# EAGLE schematic Schematic (EAGLE 8.3.2)
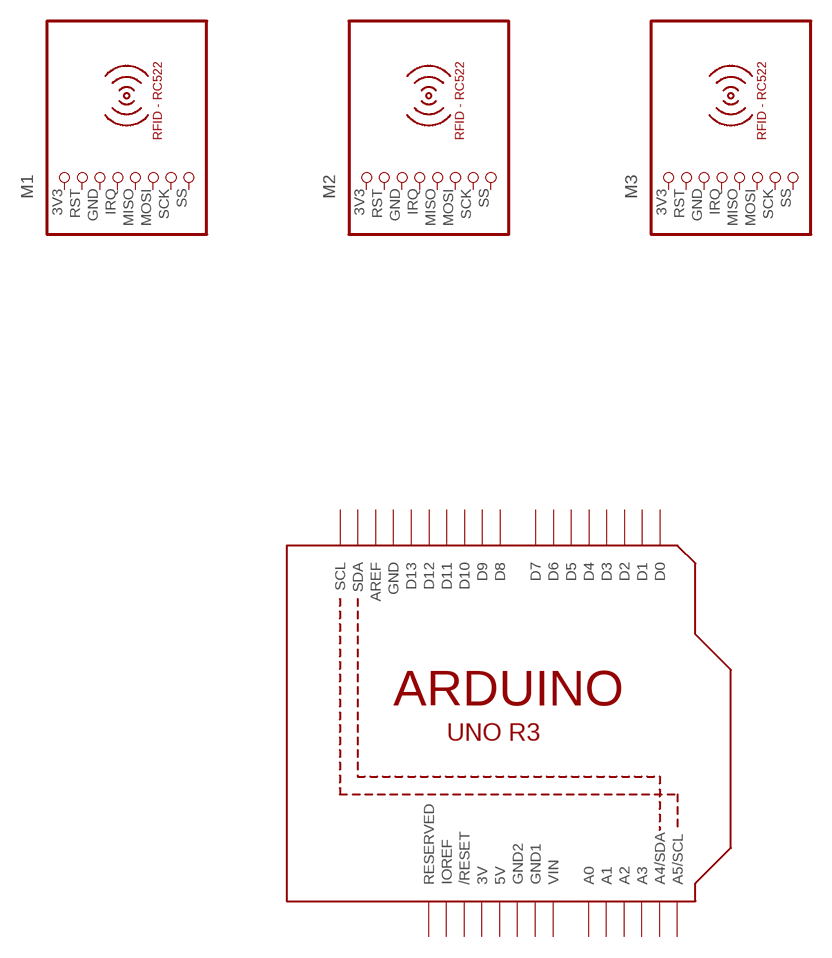
[diagram p0: schematic, sheet 1]

## Parts
M1  RFID-RC522  [RFID-RC522]
M2  RFID-RC522  [RFID-RC522]
M3  RFID-RC522  [RFID-RC522]
U1  ARDUINOR3-BPLACE  [ARDUINOR3-BPLACE]
Unconnected: M1.3V3 M1.GND M1.IRQ M1.MISO M1.MOSI M1.RST M1.SCK M1.SS M2.3V3 M2.GND M2.IRQ M2.MISO M2.MOSI M2.RST M2.SCK M2.SS M3.3V3 M3.GND M3.IRQ M3.MISO M3.MOSI M3.RST M3.SCK M3.SS U1.A0 U1.A1 U1.A2 U1.A3 U1.A4(A4/SDA) U1.A5(A5/SCL) U1.AREF U1.D0 U1.D1 U1.D2 U1.D3 U1.D4 U1.D5 U1.D6 U1.D7 U1.D8 U1.D9 U1.D10 U1.D11 U1.D12 U1.D13 U1.IOREF U1.RESERVED U1.RESET(/RESET) U1.SCL U1.SDA

## Power pins joined to a net without a drawn wire
3V: U1.3V
5V: U1.5V
GND: U1.GND
GND1: U1.GND1
GND2: U1.GND2
VIN: U1.VIN

## Library data of the parts
M1-M3 = mfrc522-module:RFID-RC522: RFID-RC522 MFRC-522 based breakout board
U1 = adafruit:ARDUINOR3: This is a new object for the new Arduino R3 - with extra pins that you may want to use (such as IOref, and duplicated A4/A5